# EasyEDA schematic Schematic.json
TITLE: BrightestDungeon; REV: 1.0; Date: 2022-01-23; Sheet: 1/1; Drawn By: Thoh6Ogh; Company: Your Company
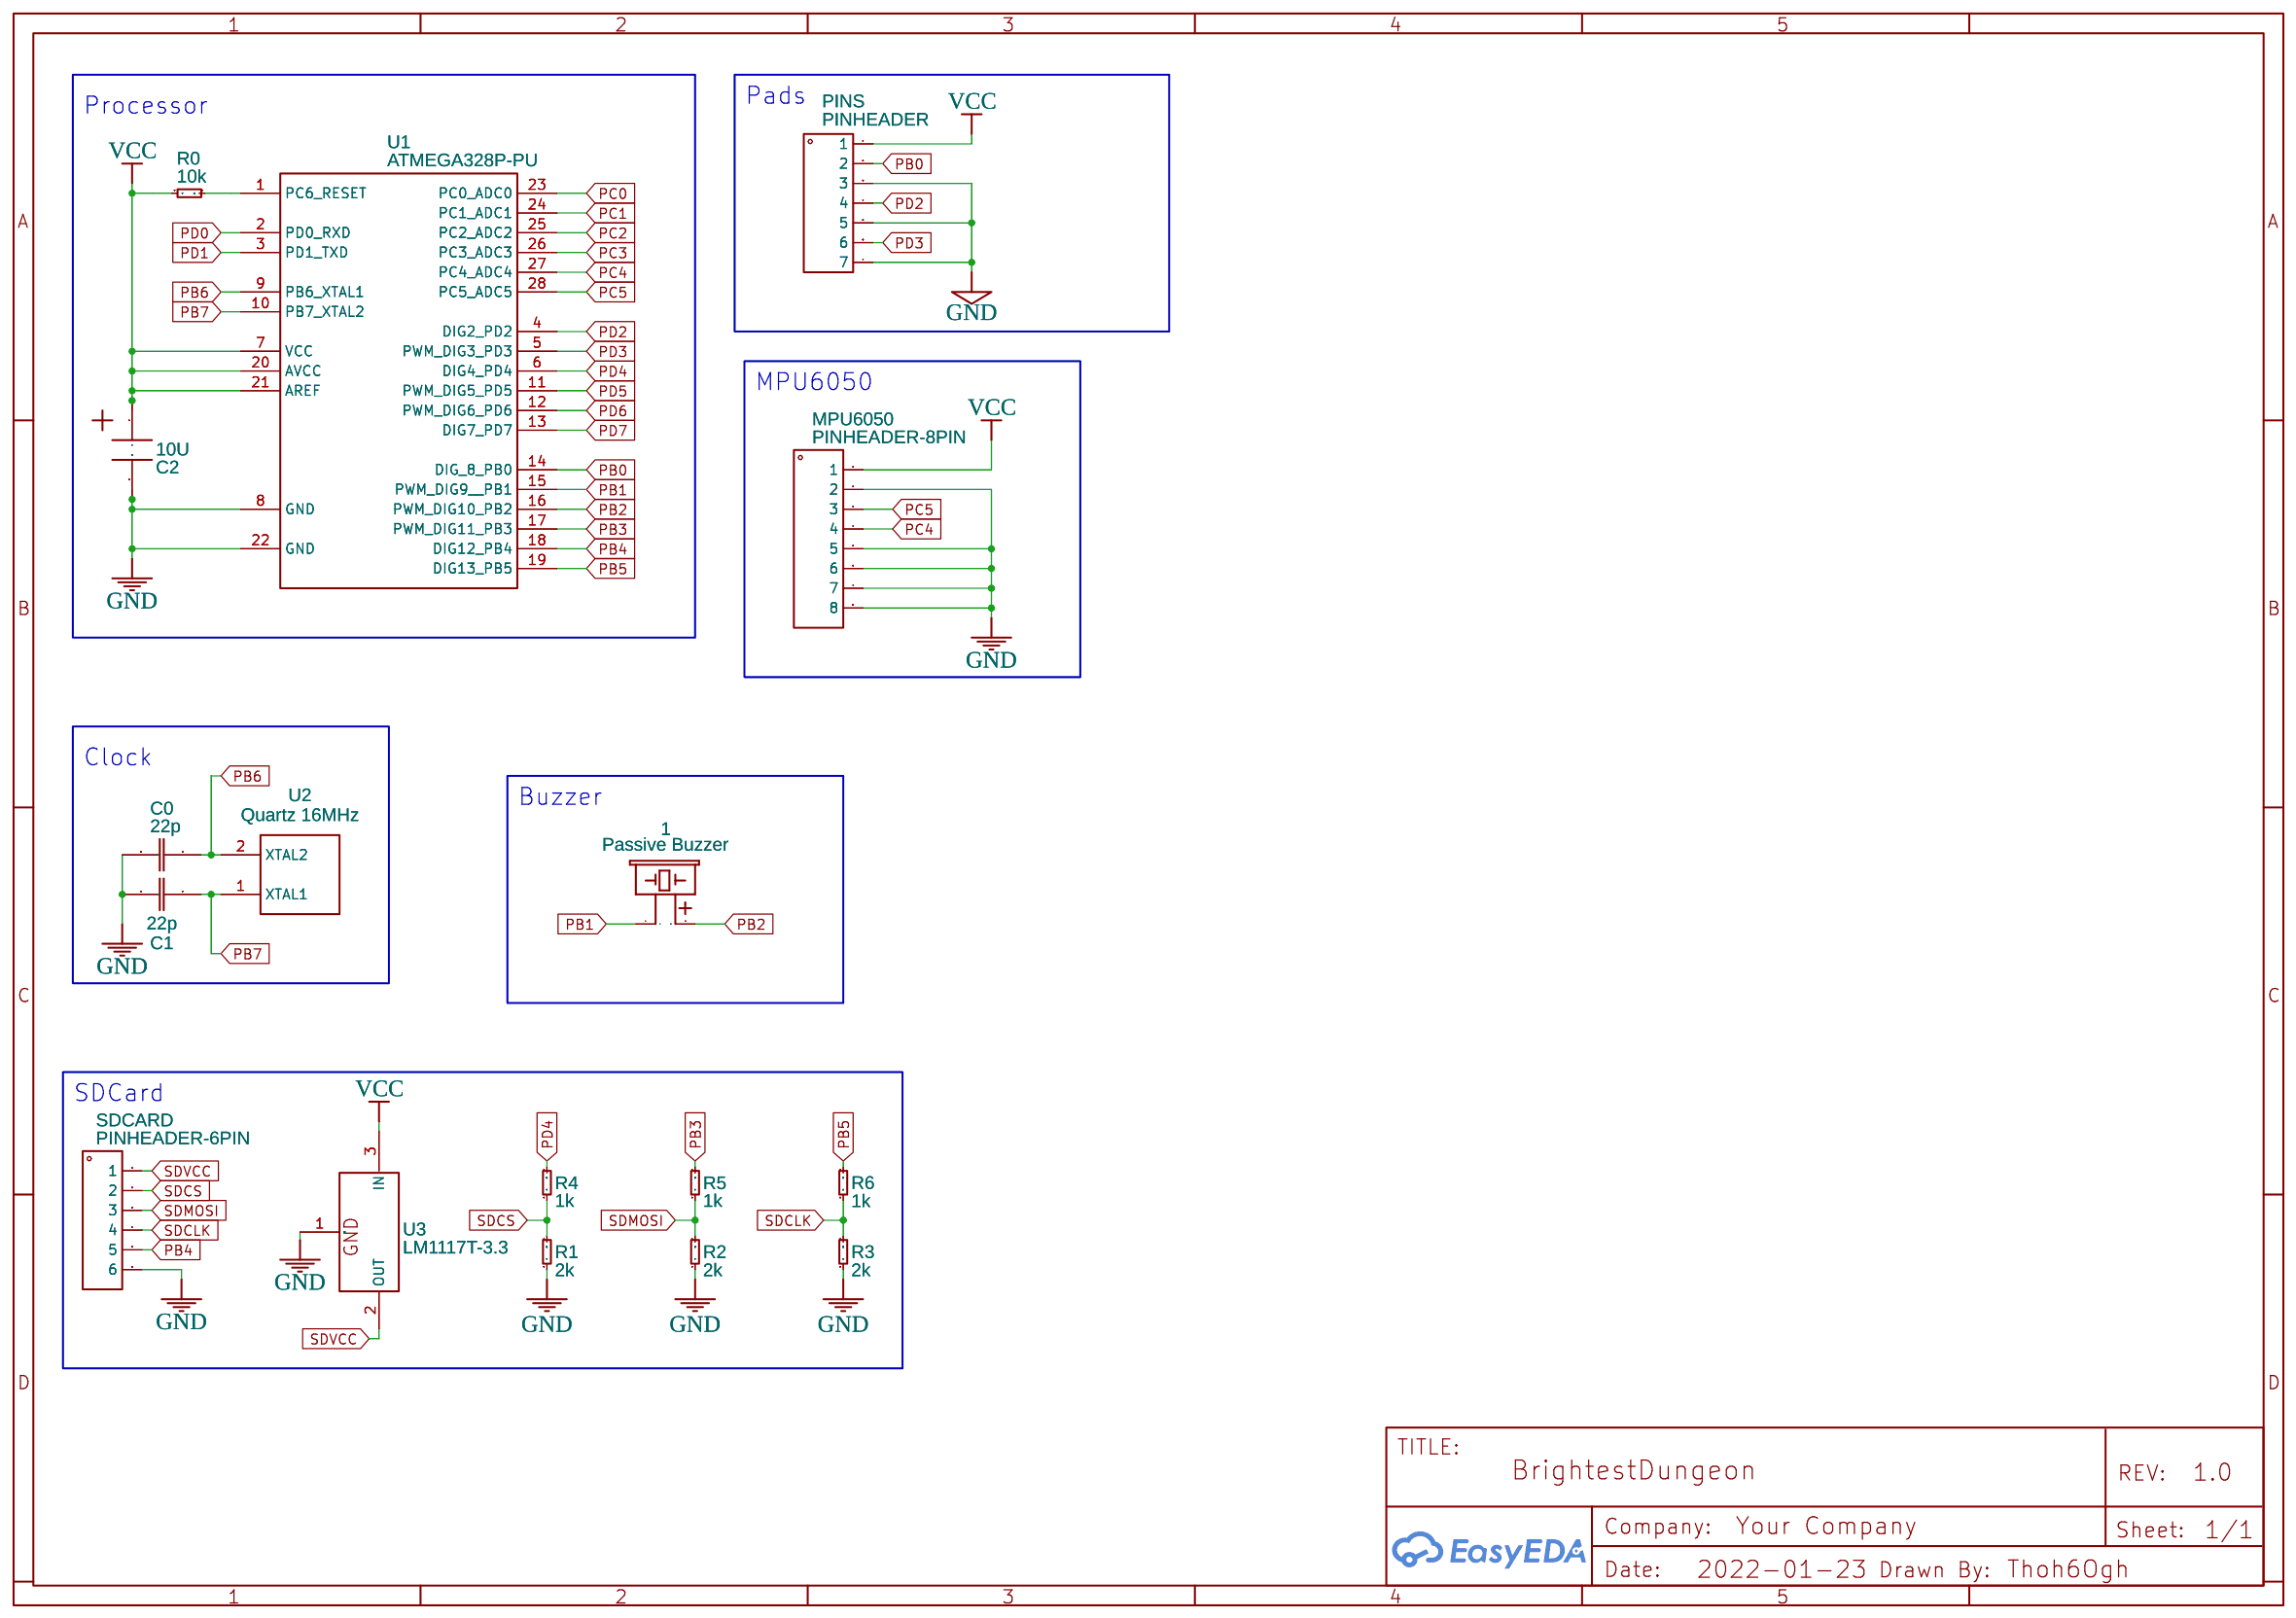
[diagram p0: schematic sheet]

## Parts
1  Passive Buzzer  [BUZZER_PASSIVE_47]
10U  C2  [CAPACITOR_3]
C0  22p  [CAPACITOR]
C1  22p  [CAPACITOR]
MPU6050  PINHEADER-8PIN  [PINHEADER-8PIN]
PINS  PINHEADER  [PINHEADER-7PIN]
R0  10k  [AXIAL-1.0]
R1  2k  [AXIAL-1.0]
R2  2k  [AXIAL-1.0]
R3  2k  [AXIAL-1.0]
R4  1k  [AXIAL-1.0]
R5  1k  [AXIAL-1.0]
R6  1k  [AXIAL-1.0]
SDCARD  PINHEADER-6PIN  [PINHEADER-6PIN]
U1  ATMEGA328P-PU  [DIP-28_300MIL]
U2  Quartz 16MHz  [MYQUARTZ]
U3  LM1117T-3.3  [TO-220-3_L10.0-W4.5-P2.54-L]

## Library data of the parts
1 = BUZZERBUZZER_PASSIVE_47: Contributor: davidegatti
10U = C3: Manufacturer Part: C?; Contributor: Zhong Robert Zhong
C0 C1 = 1u: Manufacturer: Generic Amazon; Supplier Part: undefined; Contributor: cultofsnake
MPU6050 = PINHEADER-8PIN: Contributor: MastodonteMan
PINS = PINHEADER: Contributor: Eitan Rau
R0-R6 = res: Supplier: LCSC; Supplier Part: C348861; Manufacturer: ResistorToday; Manufacturer Part: EWWR0003J250RT9; Contributor: Benon75
SDCARD = PINHEADER-6PIN: Contributor: Luthfi Ibnu Raid
U1 = ATMEGA328P-PU: sourceId: Oic6oiASL; Supplier: LCSC; Manufacturer: MICROCHIP; image: //image.lceda.cn/szlcsc/C33901.jpg; Contributor: LCSC; Supplier Part: C33901
U2 = MyQuartz16MHz: Contributor: ibex
U3 = LM1117T-3.3: Supplier: LCSC; Supplier Part: C498321; Manufacturer: HGSEMI; Contributor: LCSC; JLCPCB Part Class: Extended Part

## Nets
GND: 10U.2 C0.1 C1.1 MPU6050.2 MPU6050.5 MPU6050.6 MPU6050.7 MPU6050.8 PINS.3 PINS.5 PINS.7 R1.2 R2.2 R3.2 SDCARD.6 U1.8(GND) U1.22(GND) U3.1(GND)
VCC: 10U.1 MPU6050.1 PINS.1 R0.2 U1.7(VCC) U1.20(AVCC) U1.21(AREF) U3.3(IN)
PB0: PINS.2 U1.14(DIG 8 PB0)
PB1: 1.- U1.15(PWM DIG9  PB1)
PB2: 1.+ U1.16(PWM DIG10 PB2)
PB3: R5.1(RES) U1.17(PWM DIG11 PB3)
PB4: SDCARD.5 U1.18(DIG12 PB4)
PB5: R6.1(RES) U1.19(DIG13 PB5)
PB6: C0.2 U1.9(PB6 XTAL1) U2.2(XTAL2)
PB7: C1.2 U1.10(PB7 XTAL2) U2.1(XTAL1)
PC0: U1.23(PC0 ADC0)
PC1: U1.24(PC1 ADC1)
PC2: U1.25(PC2 ADC2)
PC3: U1.26(PC3 ADC3)
PC4: MPU6050.4 U1.27(PC4 ADC4)
PC5: MPU6050.3 U1.28(PC5 ADC5)
PD0: U1.2(PD0 RXD)
PD1: U1.3(PD1 TXD)
PD2: PINS.4 U1.4(DIG2 PD2)
PD3: PINS.6 U1.5(PWM DIG3 PD3)
PD4: R4.1(RES) U1.6(DIG4 PD4)
PD5: U1.11(PWM DIG5 PD5)
PD6: U1.12(PWM DIG6 PD6)
PD7: U1.13(DIG7 PD7)
SDCLK: R3.1(RES) R6.2 SDCARD.4
SDCS: R1.1(RES) R4.2 SDCARD.2
SDMOSI: R2.1(RES) R5.2 SDCARD.3
SDVCC: SDCARD.1 U3.2(OUT)
Net-(R0-1): R0.1(RES) U1.1(PC6 RESET)

## Notes on the sheet
- Pads
- Processor
- MPU6050
- Clock
- Buzzer
- SDCard
